# Altium schematic sheet HB_Driver1.SchDoc
size A4
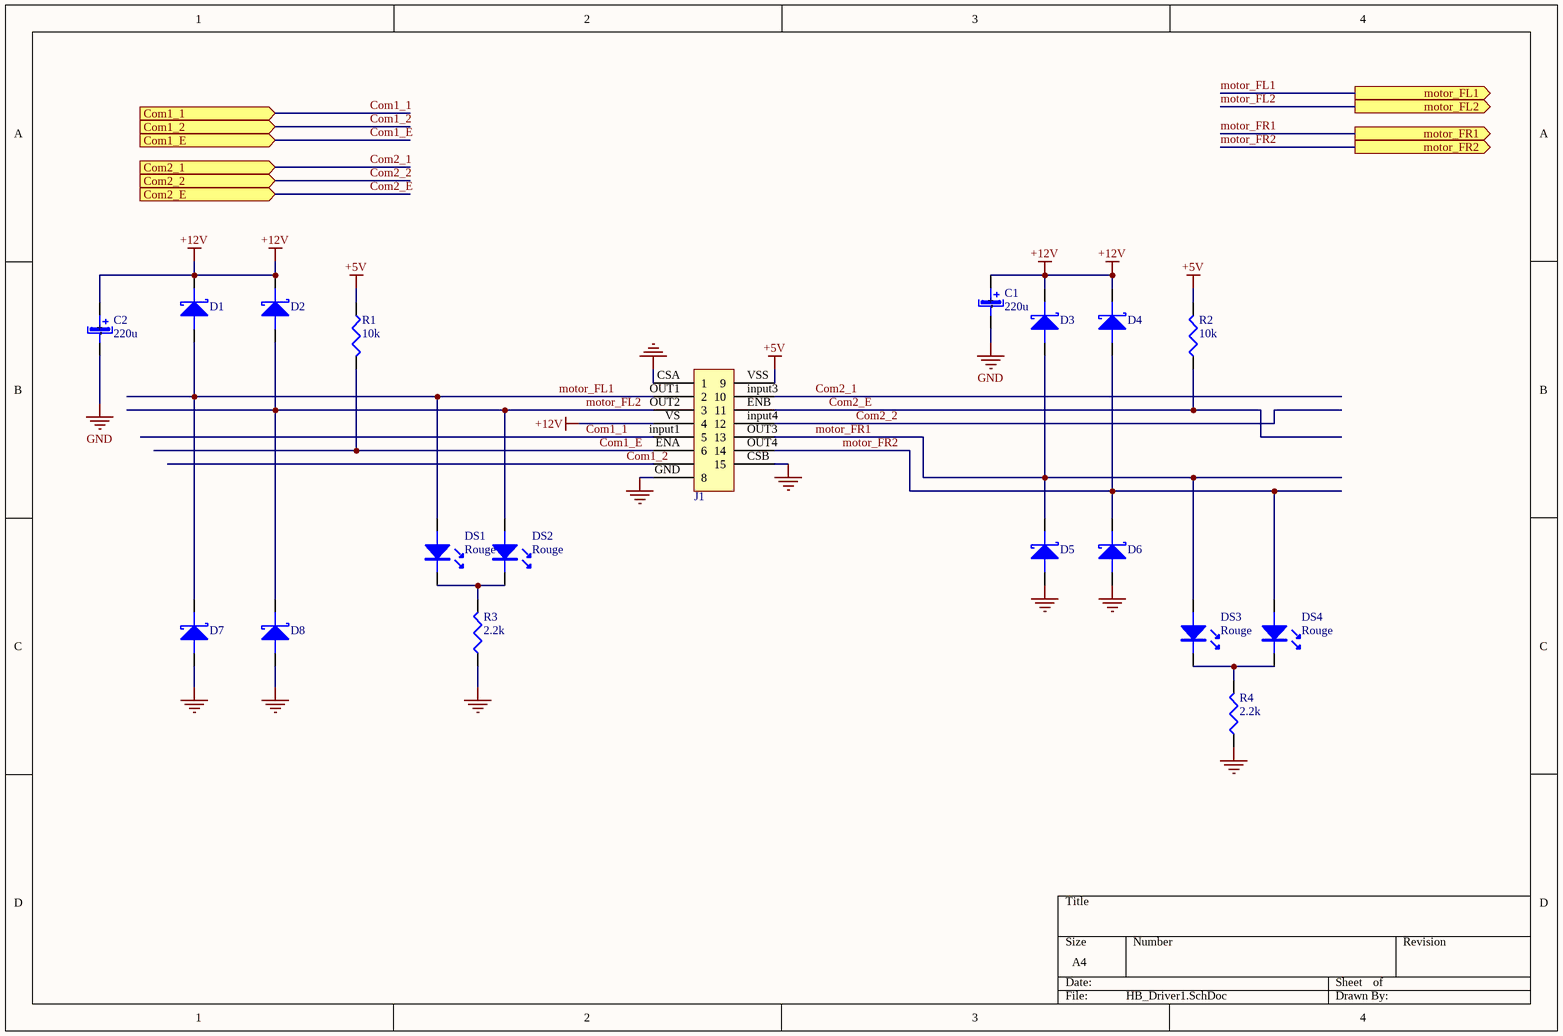
[diagram p0: HB_Driver1.SchDoc]

## Parts
C1  value 220u  [CAPAE0810X700N]  (hidden comment: Cap_220u)
C2  value 220u  [CAPAE0810X700N]  (hidden comment: Cap_220u)
D1  Diode Schottky  [SOD-123]  (value not drawn)
D2  Diode Schottky  [SOD-123]  (value not drawn)
D3  Diode Schottky  [SOD-123]  (value not drawn)
D4  Diode Schottky  [SOD-123]  (value not drawn)
D5  Diode Schottky  [SOD-123]  (value not drawn)
D6  Diode Schottky  [SOD-123]  (value not drawn)
D7  Diode Schottky  [SOD-123]  (value not drawn)
D8  Diode Schottky  [SOD-123]  (value not drawn)
DS1  Color: Rouge  [3.5X2.8X1.9]  (hidden comment: LED)
DS2  Color: Rouge  [3.5X2.8X1.9]  (hidden comment: LED)
DS3  Color: Rouge  [3.5X2.8X1.9]  (hidden comment: LED)
DS4  Color: Rouge  [3.5X2.8X1.9]  (hidden comment: LED)
J1  L298  [MultiWatt15]  (value not drawn)
R1  value 10k  [6-0805_L]  (hidden comment: Res_10k)
R2  value 10k  [6-0805_L]  (hidden comment: Res_10k)
R3  value 2.2k  [6-0805_L]  (hidden comment: Res_2.2k)
R4  value 2.2k  [6-0805_L]  (hidden comment: Res_2.2k)

## Ports
Com1_1 (in), Com1_2 (in), Com1_E (in), Com2_1 (in), Com2_2 (in), Com2_E (in), motor_FL1 (out), motor_FL2 (out), motor_FR1 (out), motor_FR2 (out)

## Nets
+5V: J1.VSS(9) R1.1 R2.2
+12V: C1.POS(+) C2.POS(+) D1.1(K) D2.1(K) D3.1(K) D4.1(K) J1.VS(4)
GND: C1.NEG(-) C2.NEG(-) D5.2(A) D6.2(A) D7.2(A) D8.2(A) J1.CSA(1) J1.CSB(15) J1.GND(8) R3.1 R4.1
Com1_1: J1.input1(5) ; port Com1_1
Com1_2: J1.input2 ; port Com1_2
Com1_E: J1.ENA(6) R1.2 ; port Com1_E
Com2_1: J1.input3(10) ; port Com2_1
Com2_2: J1.input4(12) ; port Com2_2
Com2_E: J1.ENB(11) R2.1 ; port Com2_E
motor_FL1: D1.2(A) D7.1(K) DS1.1(A) J1.OUT1(2) ; port motor_FL1
motor_FL2: D2.2(A) D8.1(K) DS2.1(A) J1.OUT2(3) ; port motor_FL2
motor_FR1: D3.2(A) D5.1(K) DS3.1(A) J1.OUT3(13) ; port motor_FR1
motor_FR2: D4.2(A) D6.1(K) DS4.1(A) J1.OUT4(14) ; port motor_FR2
NetDS1_2: DS1.2(K) DS2.2(K) R3.2
NetDS3_2: DS3.2(K) DS4.2(K) R4.2

## Library data of the parts
C1 C2 = Cap_220u: Condensateur polatisé; Type: Condensateur polarisé debout; Designer: ECAM 2004; Supplier: RS 537-0641
J1 = L298: Connecteur; Designer: ECAM 2004; Supplier: ECAM
R1 R2 = Res_10k: Résistance standard; Designer: ECAM 2005; Supplier: RS 740-8805; Type: Résistance standard
R3 R4 = Res_2.2k: Résistance standard; Designer: ECAM 2005; Supplier: RS 679-1207; Type: Résistance standard
D1-D8 = Diode Schottky: Designer: ECAM 2005; Supplier: RS 708-2197
DS1-DS4 = LED: Designer: ECAM 2004; Type: LED; Supplier: RS 176-6077